# Altium schematic sheet VX.SchDoc: Name project title here
size A4; DocumentNumber: No here; SheetNumber: 1; SheetTotal: 1
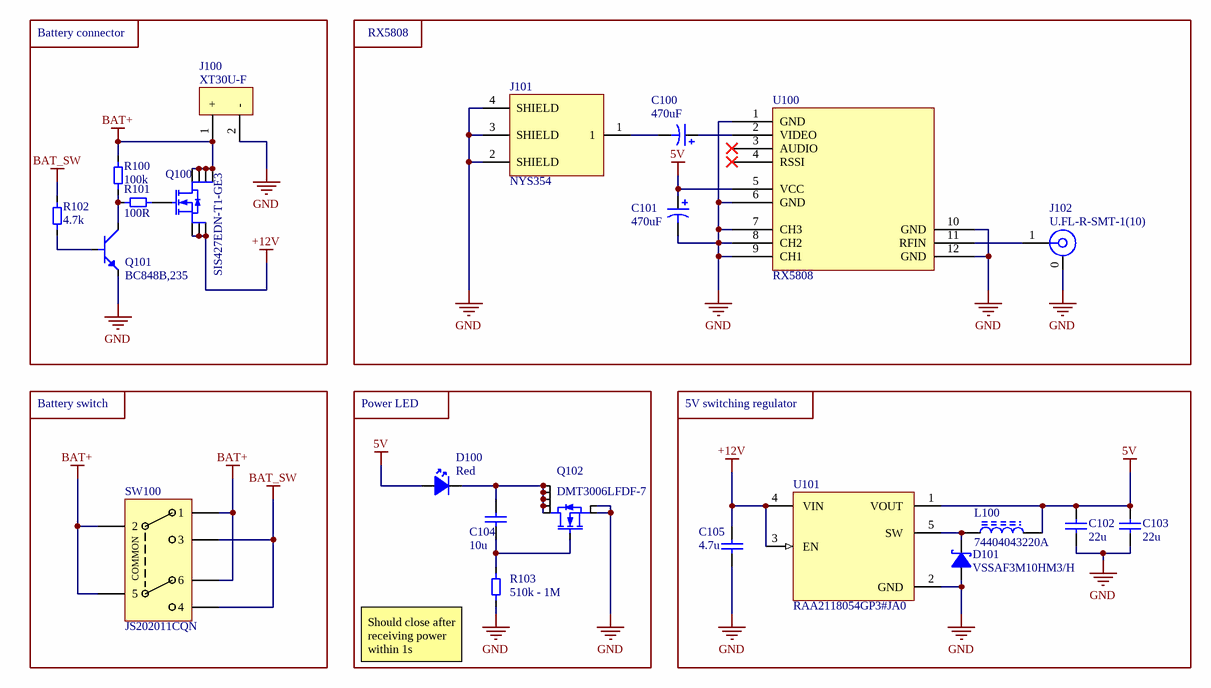
[diagram p0: VX.SchDoc]

## Parts
C100  Capacitance: 470uF  [T521X337M016ATE050-Footprint-1]  (hidden comment: T55D477M6R3C0015)
C101  Capacitance: 470uF  [T521X337M016ATE050-Footprint-1]  (hidden comment: T55D477M6R3C0015)
C102  22u  [MLCC_1206_M]
C103  22u  [MLCC_1206_M]
C104  10u  [MLCC_0805_M]
C105  4.7u  [MLCC_1206_M]
D100  Red  [0603 RED LED]
D101  VSSAF3M10HM3/H  [VSSAF3M10HM3_H-Footprint-1]
J100  XT30U-F  [XT30U-F]
J101  NYS354  [NYS354]
J102  U.FL-R-SMT-1(10)  [FP-U_FL-R-SMT-1_10-MFG]
L100  74404043220A  [WE-LQS_4025]
Q100  SIS427EDN-T1-GE3  [Copy of TPN2R304PL,L1Q-Footprint-1]
Q101  BC848B,235  [SOT-23-3]
Q102  DMT3006LFDF-7  [DMT3006LFDF-7]
R100  100k  [Resistor_0603_M]
R101  100R  [Resistor_0603_M]
R102  4.7k  [Resistor_0603_M]
R103  510k  [Resistor_0603_M]
SW100  JS202011CQN  [FP-JS202011CQN-MFG]
U100  RX5808  [RX5808-Footprint-1]
U101  RAA2118054GP3#JA0  [P5_064B_MFG]

## Blocks framed on the sheet
Battery connector: J100 Q100 Q101 R100-R102
RX5808: C100 C101 J101 J102 U100
Battery switch: SW100
5V switching regulator: C102 C103 C105 D101 L100 U101

## Nets
5V: C101.1 C102.2 C103.2 D100.2(A) L100.2 U100.5(VCC) U101.1(VOUT)
+12V: C105.2 Q100.1(S) Q100.2(S) Q100.3(S) U101.3(EN) U101.4(VIN)
BAT+: J100.1(+) Q100.5(D) Q100.6(D) Q100.7(D) Q100.8(D) R100.2 SW100.1 SW100.2 SW100.5 SW100.6
BAT_SW: R102.2 SW100.3 SW100.4
GND: C101.2 C102.1 C103.1 C105.1 D101.2(A) J100.2(-) J101.2(SHIELD) J101.3(SHIELD) J101.4(SHIELD) J102.0(GND) Q101.2(E) Q102.4(S) Q102.8(S) R103.1 U100.1(GND) U100.6(GND) U100.7(CH3) U100.8(CH2) U100.9(CH1) U100.10(GND) U100.12(GND) U101.2(GND)
NetC100_1: C100.1 U100.2(VIDEO)
NetC100_2: C100.2 J101.1
NetC104_1: C104.1 Q102.3(G) R103.2
NetC104_2: C104.2 D100.1(C) Q102.1(D) Q102.2(D) Q102.5(D) Q102.6(D) Q102.7(D)
NetD101_1: D101.1(C) L100.1 U101.5(SW)
NetJ102_1: J102.1(SIG) U100.11(RFIN)
NetQ100_4: Q100.4(G) R101.2
NetQ101_1: Q101.1(B) R102.1
NetQ101_3: Q101.3(C) R100.1 R101.1

Not connected (* = marked no-connect by the designer): U100 3(AUDIO)* 4(RSSI)*

## Notes on the sheet
- Power LED
- - 1M
- (near R103) Should close after receiving power within 1s
- Project:
- Title:
- Revision:
- Date:
- Size:
- A4
- Sheet:
- of
- Variant:
- Revision R&D:
- Checked By:
- Last modified:
- This document and its contents are the property of =GlobalCompanyName . Any unauthorized reproduction, distribution, or disclosure to third parties of this document or its contents, in whole or in part, without prior written agreement from =GlobalCompanyName is strictly prohibited and may be subject to legal action.
- (in symbol CMP-ROOT-01260-4) COMMON

## Library data of the parts
C100 C101 = CMP-001-1777-1: Cap Tant Polymer 470uF 6.3VDC D CASE 20% (7.3 X 4.3 X 2.8mm) SMD 7343-31 0.015 Ohm 105C T/R; Manufacturer: Vishay; Voltage: 6.3V; Leakage Current: 296uA; Dissipation Factor: 10%; Capacitor Type: Tantalum; ESR (Equivalent Series Resistance): 15mR; Value: 470µF; Tolerance: 20%; Min Operating Temperature: -55°C; Lead Pitch: 3.8mm; Length: 7.3mm; REACH SVHC: No SVHC; Part number: T55D477M6R3C0015; Depth: 4.3mm; Mount: SMD; Case/Package: 2917; RoHS: Yes; Max Operating Temperature: 105°C; Pins: 2; Height: 2.8mm; Dielectric: Tantalum
C102 C103 = CMP-001-1113-2: MLCC, 1206, 22u, 10%, 16V, X5R; Manufacturer: Any; Value: 22µF; Capacitor Type: Ceramic; Part number: MLCC, 1206, 22u, 10%, 16V, X5R; RoHS: Yes; Dielectric: X5R; Voltage: 16V; Tolerance: 10%; Mount: SMD; Case/Package: 1206
C104 = CMP-001-0829-2: MLCC, 0805, 10u, 10%, 50V, X5R; Manufacturer: Any; Value: 10µF; Capacitor Type: Ceramic; RoHS: Yes; Tolerance: 10%; Voltage: 50V; Mount: SMD; Case/Package: 0805; Part number: MLCC, 0805, 10u, 10%, 50V, X5R; Dielectric: X5R
C105 = CMP-001-1124-2: MLCC, 1206, 4.7u, 10%, 35V, X5R; Manufacturer: Any; Capacitor Type: Ceramic; Value: 4,7µF; RoHS: Yes; Part number: MLCC, 1206, 4.7u, 10%, 35V, X5R; Voltage: 35V; Tolerance: 10%; Case/Package: 1206; Dielectric: X5R; Mount: SMD
D100 = CMP-ROOT-00025-2: Generic red 0603 LED; Part number: Any Red 0603 LED; Manufacturer: Any; Color: Red; Case/Package: 0603; Mount: SMD; RoHS: Yes
D101 = CMP-ROOT-01308-2: Rectifier Diode, Schottky, 1 Phase, 1 Element, 2.3A, 100V V(RRM), Silicon, DO-221AC; Forward Voltage: 720mV; Max Forward Surge Current (Ifsm): 80A; Number of Elements: 1; Peak Reverse Current: 200µA; Case/Package: DO-221AC-2; Manufacturer: VSSAF3M10HM3/H; Mount: SMD; Part number: VSSAF3M10HM3/H; Pins: 2; RoHS: Compliant; Lifecycle Status: Production; Max Operating Temperature: 175°C; Max Output current: 2.3A; Min Operating Temperature: -40°C; Number of Terminals: 2; REACH SVHC: No; Reverse Standoff Voltage: 100V
J100 = CMP-ROOT-01262-6: Power Connector; Manufacturer: AMASS; Case/Package: Non-standard; Mount: SMD; Part number: XT30U-F; Pins: 2; RoHS: Yes; Color: Yellow; Contact Material: Brass; Orientation: Straight
J101 = CMP-ROOT-01344-2: RCA Phono Connector Shielded Right Angle Solder Pin; Manufacturer: REAN; Ports: 1; Mount: TH; Part number: NYS354; Pins: 4; RoHS: Yes; Contact Plating: Nickel; Contact Material: Brass
J102 = CMP-ROOT-01143-2: RF CONNECTOR RF Connector, 1 Contact(s), Male, Board Mount, Surface Mount Terminal, Receptacle; Manufacturer: Hirose Electric Co Ltd; Body Material: Bronze; Body Plating: Silver; Center Contact Plating: Gold; Connector Type: Receptacle,Male Pin; Dielectric Material: Polymer; Impedance: 50R; Insulation Resistance: 500MR; Mating Cycles: 30; Clock Frequency: 6GHz; Number of Contacts: 1; Voltage Rating: 60V; Mount: TH; Part number: U.FL-R-SMT-1(10); Pins: 2; RoHS: Yes; Contact Material: Brass; Fastening Type: SNAP-ON; Housing Color: Beige; Lead Free: Lead Free; Max Operating Temperature: 90°C; Min Operating Temperature: -40°C; Mounting Technology: Surface Mount; Number of Ports: 1; Orientation: Straight; Package Quantity: 2500; Packaging: Tape and Reel; Series: U.FL; Termination: Solder; Weight: 0.001764oz
L100 = CMP-ROOT-01309-1: General Purpose Inductor, 22uH, 20%, 1 Element, Nickel-zinc Ferrite-Core, SMD, 1616; Manufacturer: Wurth Elektronik; Value: 22µH; Current Rating: 1.11A; DC Resistance (DCR): 200mΩ; Case/Package: 4mm x 4mm; Mount: SMD; Part number: 74404043220A; Pins: 2; RoHS: Compliant; Ambient Temperature Range High: 85°C; Ambient Temperature Range Low: -40°C; Height: 2.5mm; Inductance Tolerance: 20%; Length: 4mm; Max Operating Temperature: 125°C; Min Operating Temperature: -40°C; Width: 4mm
Q100 = CMP-ROOT-01317-2: Trans MOSFET P-CH 30V 15A 8-Pin PowerPAK EP T/R; Manufacturer: Vishay Siliconix; Continuous Drain Current (ID): 50A; Drain to Source Breakdown Voltage: -30V; Drain to Source Resistance: 10.6mΩ; Element Configuration: Single; Fall Time: 12ns; Gate to Source Voltage (Vgs): 25V; Input Capacitance: 1.93nF; Max Power Dissipation: 52W; Number of Channels: 1; Rise Time: 40ns; Turn-Off Delay Time: 28ns; Turn-On Delay Time: 45ns; Case/Package: PowerPAK® 1212-8; Mount: SMD; Part number: SIS427EDN-T1-GE3; Pins: 8; RoHS: Compliant; Drain to Source Voltage (Vdss): 30V; Export Control Classification Number (ECCN) Code: EAR99; Introduction Date: 2013-06-25; Lifecycle Status: Production; Max Operating Temperature: 150°C; Min Breakdown Voltage: 30V; Min Operating Temperature: -55°C; Mounting Technology: Surface Mount; Number of Elements: 1; Number of Terminals: 5; REACH SVHC: Unknown; Radiation Hardening: No; Rds On Max: 10.6mΩ; Schedule B: 8541290080
Q101 = CMP-ROOT-01328-1: Small Signal Bipolar Transistor, 0.1A I(C), 30V V(BR)CEO, 1-Element, NPN, Silicon, TO-236AB; Manufacturer: Nexperia; Manufacturer Lifecycle Status: RELEASED FOR SUPPLY; Collector Emitter Saturation Voltage: 600mV; Element Configuration: Single; Emitter Base Voltage (VEBO): 5V; Frequency: 100MHz; Max Collector Current: 100mA; Max Power Dissipation: 250mW; Number of Elements: 1; hFE Min: 200; Case/Package: SOT-23; Mount: SMD; Part number: BC848B,235; Pins: 3; RoHS: Compliant; China RoHS: Compliant; Collector Base Voltage (VCBO): 30V; Collector Emitter Breakdown Voltage: 30V; Collector Emitter Voltage (VCEO): 30V; Contact Plating: Tin; Gain Bandwidth Product: 100MHz; Lifecycle Status: Production; Max Operating Temperature: 150°C; Min Operating Temperature: -65°C; Mounting Technology: Surface Mount; Number of Terminals: 3; Polarity: NPN; Power Dissipation: 250mW; REACH SVHC: Yes; Radiation Hardening: No; Transition Frequency: 100MHz
Q102 = CMP-ROOT-01331-1: Mosfet, N-Ch, 30V, 14.1A, Udfn2020 Rohs Compliant: Yes; Manufacturer: Diodes Incorporated; Drain to Source Resistance: 7mΩ; Input Capacitance: 1.32nF; Max Power Dissipation: 2.1W; Number of Elements: 1; Case/Package: DFN-2020-6; Mount: SMD; Part number: DMT3006LFDF-7; Pins: 8; RoHS: Compliant; China RoHS: Compliant; Continuous Drain Current (ID): 14.1A; Drain to Source Voltage (Vdss): 30V; Lifecycle Status: Production; Max Operating Temperature: 150°C; Min Breakdown Voltage: 30V; Min Operating Temperature: -55°C; Mounting Technology: Surface Mount; Number of Terminals: 6; REACH SVHC: Yes; Rds On Max: 7mΩ
R100 = CMP-001-0125-2: Resistor, 0603, 100k, 1%, 1/10W; Manufacturer: Any; Power: 100mW; Tolerance: 1%; Part number: Resistor, 0603, 100k, 1%, 1/10W; Mount: SMD; RoHS: Yes; Case/Package: 0603; Value: 100k
R101 = CMP-001-0054-5: Resistor, 0603, 100R, 1%, 1/10W; Manufacturer: Any; Value: 100; Power: 100mW; Case/Package: 0603; Mount: SMD; Part number: Resistor, 0603, 100R, 1%, 1/10W; Tolerance: 1%; RoHS: Yes
R102 = CMP-001-0093-2: Resistor, 0603, 4.7k, 1%, 1/10W; Manufacturer: Any; Power: 100mW; Value: 4,7k; Part number: Resistor, 0603, 4.7k, 1%, 1/10W; Case/Package: 0603; RoHS: Yes; Tolerance: 1%; Mount: SMD
R103 = CMP-001-0142-2: Resistor, 0603, 510k, 1%, 1/10W; Manufacturer: Any; Power: 100mW; Tolerance: 1%; RoHS: Yes; Mount: SMD; Case/Package: 0603; Value: 510k; Part number: Resistor, 0603, 510k, 1%, 1/10W
SW100 = CMP-ROOT-01260-4: Slide Switch, 1 Positions, Dpdt, Latched, 0.3A, 6Vdc, 6 Pcb Hole Cnt, Solder Terminal, Through; Manufacturer: C&K; Actuator Length: 2.0066mm; Actuator Material: Nylon; Contact Current Rating: 300mA; Contact Resistance: 70mΩ; Electrical Life: 5kcycles; Illumination Type: Non-Illuminated; Insulation Resistance: 100MΩ; Max Voltage Rating (DC): 6V; Number of Positions: 1; Switch Function: On-On; Switch Travel: 2mm; Case/Package: Non-standard; Mount: SMD; Part number: JS202011CQN; Pins: 6; RoHS: Compliant; Color: Black; Contact Plating: Silver; Current Rating: 300mA; Depth: 3.6mm; Flammability Rating: UL94 V-0; Height: 3.5mm; Housing Material: Nylon; Lead Free: Lead Free; Length: 9mm; Life (Cycles): 5kcycles; Lifecycle Status: Production; Max Current Rating: 300mA; Max Operating Temperature: 85°C; Min Operating Temperature: -40°C; Mounting Technology: Through Hole; Orientation: Vertical; Packaging: Bulk; REACH SVHC: Yes; Radiation Hardening: No; Terminal Material: Brass; Termination: PC Pins; Throw Configuration: DPDT; Voltage Rating (DC): 6V
U100 = CMP-ROOT-01340-1: RX5808 Video Module; Manufacturer: Unknown; Case/Package: Module; Mount: SMD; Part number: RX5808; Pins: 12; RoHS: Yes
U101 = CMP-00019-3: Switching Regulator, Current-mode, 0.3A, 230kHz Switching Freq-Max, PDSO5; Manufacturer Lifecycle Status: ACTIVE; Manufacturer: Renesas / Intersil; Max Supply Voltage: 80V; Max Junction Temperature (Tj): 125°C; Max Output current: 300mA; Max Output Voltage: 5.15V; Min Input Voltage: 7V; Min Output Voltage: 3.18V; Nominal Supply Voltage: 18V; Nominal Output Voltage: 5V; Number of Circuits: 1; Pitch: 1mm; Topology: Buck; Case/Package: TSOT; Export Control Classification Number (ECCN) Code: EAR99; Harmonized Tariff Schedule (HTS) Code: 8540000000; Height: 850µm; Height - Seated (Max): 1.1mm; Length: 2.9mm; Lifecycle Status: Production; MSL: 3; Max Operating Temperature: 125°C; Max Switching Frequency: 230kHz; Min Operating Temperature: -40°C; Mounting Technology: Surface Mount; Pins: 5; Number of Terminals: 5; Package Quantity: 3000; Part Family: RAA211805; REACH SVHC: Yes; RoHS: Compliant; Terminal Pitch: 950µm; Width: 1.6mm; Mount: SMD; Part number: RAA2118054GP3#JA0